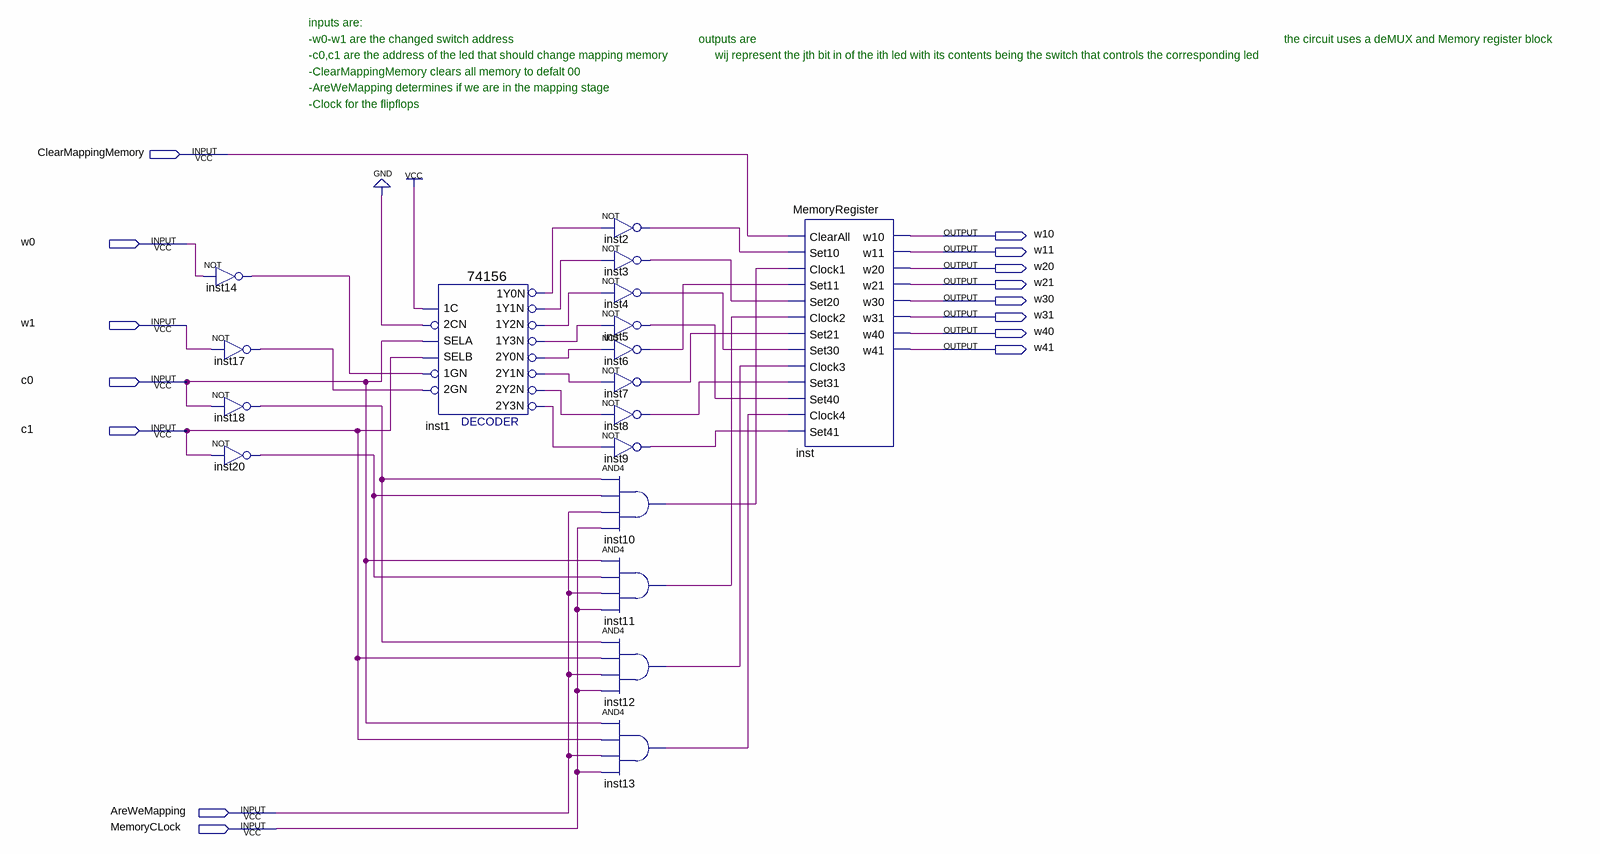
[diagram p0: schematic sheet]
// Quartus schematic MappingMemory.bdf as structural Verilog: 18 symbols, 15 pins
module MappingMemory (
  input  ClearMappingMemory,
  input  w0,
  input  w1,
  input  c0,
  input  c1,
  input  AreWeMapping,
  input  MemoryCLock,
  output w10,
  output w11,
  output w20,
  output w21,
  output w30,
  output w31,
  output w40,
  output w41
);

  wire inst1_1y0n, inst1_1y1n, inst1_1y2n, inst1_1y3n, inst1_2y0n, inst1_2y1n, inst1_2y2n, inst1_2y3n,
       inst2_out, inst3_out, inst4_out, inst5_out, inst6_out, inst7_out, inst8_out, inst9_out, inst10_out,
       inst11_out, inst12_out, inst13_out, inst14_out, inst17_out, inst18_out, inst20_out;

  not inst14 (inst14_out, w0);
  not inst17 (inst17_out, w1);
  not inst18 (inst18_out, c0);
  not inst20 (inst20_out, c1);
  \74156  inst1 (
    .SELA(c0), .\2CN (1'b0), .\1C (1'b1), .\2GN (inst17_out), .\1GN (inst14_out), .SELB(c1),
    .\1Y0N (inst1_1y0n), .\1Y3N (inst1_1y3n), .\2Y0N (inst1_2y0n), .\1Y2N (inst1_1y2n), .\1Y1N (inst1_1y1n),
    .\2Y3N (inst1_2y3n), .\2Y1N (inst1_2y1n), .\2Y2N (inst1_2y2n));
  not inst2 (inst2_out, inst1_1y0n);
  not inst3 (inst3_out, inst1_1y1n);
  not inst4 (inst4_out, inst1_1y2n);
  not inst5 (inst5_out, inst1_1y3n);
  not inst6 (inst6_out, inst1_2y0n);
  not inst7 (inst7_out, inst1_2y1n);
  not inst8 (inst8_out, inst1_2y2n);
  not inst9 (inst9_out, inst1_2y3n);
  and inst10 (inst10_out, inst18_out, inst20_out, AreWeMapping, MemoryCLock);
  and inst11 (inst11_out, c0, inst20_out, AreWeMapping, MemoryCLock);
  and inst12 (inst12_out, inst18_out, c1, AreWeMapping, MemoryCLock);
  and inst13 (inst13_out, c0, c1, AreWeMapping, MemoryCLock);
  MemoryRegister inst (
    .ClearAll(ClearMappingMemory), .Set10(inst2_out), .Clock1(inst10_out), .Set11(inst6_out),
    .Set20(inst3_out), .Clock2(inst11_out), .Set21(inst7_out), .Set30(inst4_out), .Clock3(inst12_out),
    .Set31(inst8_out), .Set40(inst5_out), .Clock4(inst13_out), .Set41(inst9_out), .w10(w10), .w11(w11),
    .w20(w20), .w21(w21), .w30(w30), .w31(w31), .w40(w40), .w41(w41));

  // Notes on the sheet:
  //   inputs are:
  //   -w0-w1 are the changed switch address
  //   outputs are
  //   the circuit uses a deMUX and Memory register block
  //   -c0,c1 are the address of the led that should change mapping memory
  //   wij represent the jth bit in of the ith led with its contents being the switch that controls the corresponding led
  //   -ClearMappingMemory clears all memory to defalt 00
  //   -AreWeMapping determines if we are in the mapping stage
  //   -Clock for the flipflops
endmodule
